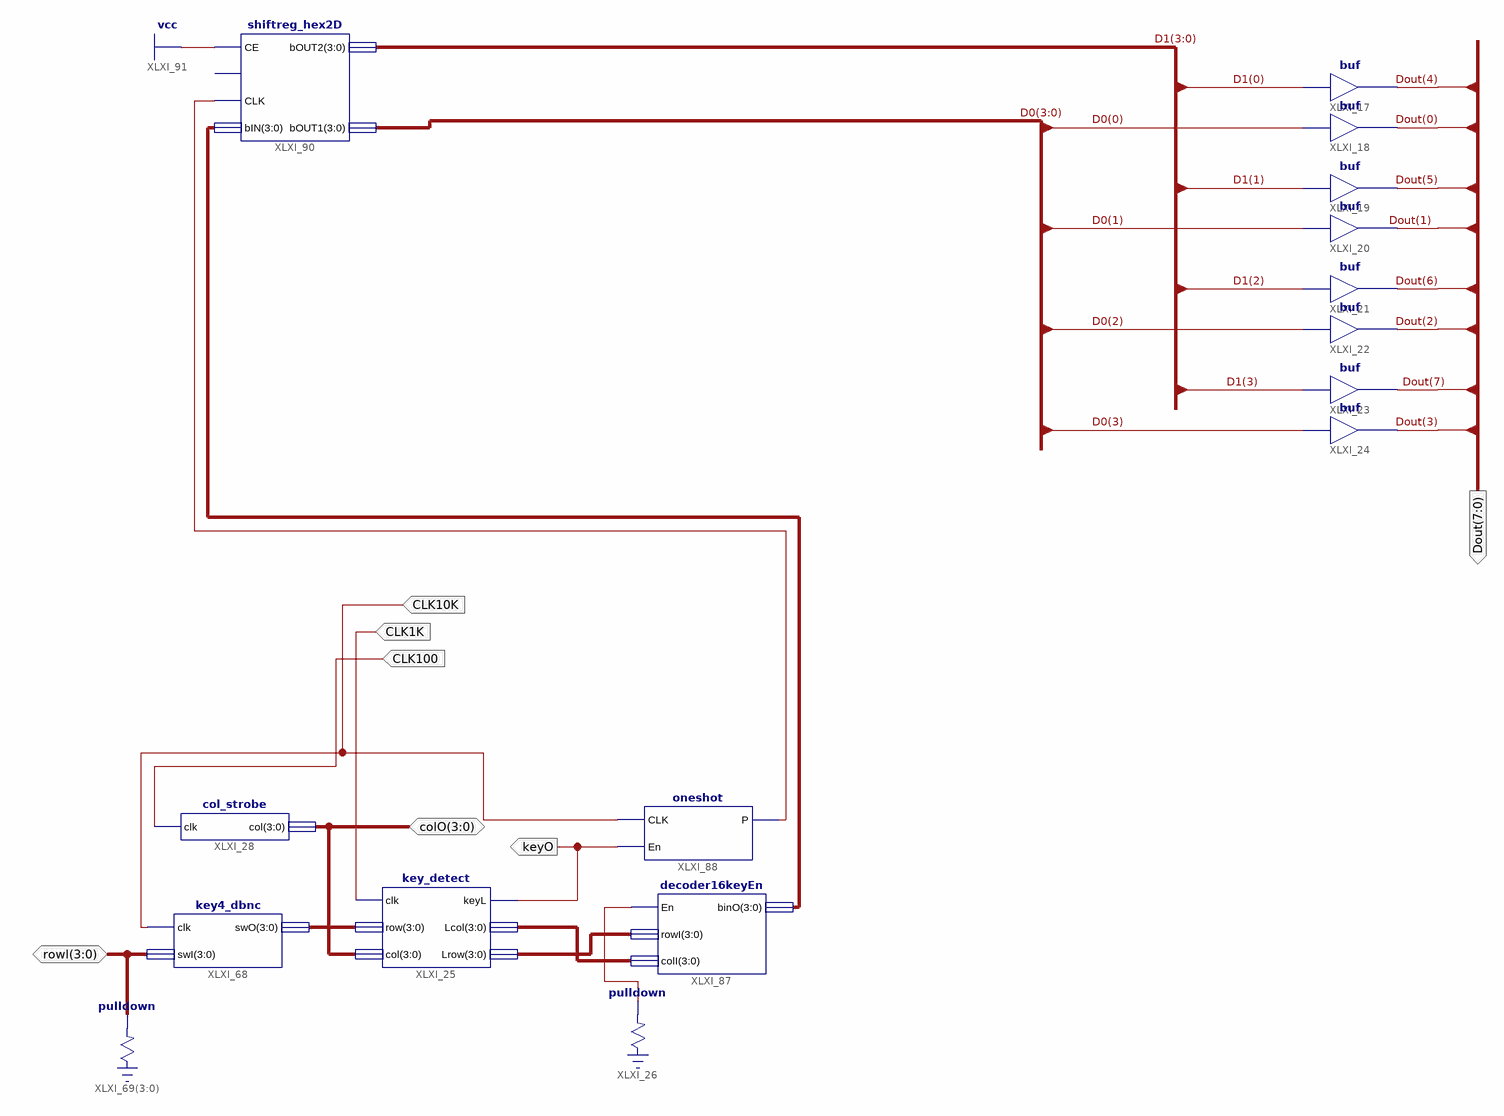
[diagram p0: schematic sheet 1]
// Xilinx ISE schematic keypadM.sch (spartan3e) as structural Verilog: 16 symbols, 7 ports
module keypadM (
  input  CLK1K,
  input  CLK100,
  input  CLK10K,
  inout  [3:0] rowl,
  inout  [3:0] colO,
  output [7:0] Dout,
  output keyO
);

  wire XLXN_27, XLXN_336;
  wire [3:0] D0, D1, XLXN_25, XLXN_26, XLXN_29, XLXN_337;

  buf XLXI_17 (Dout[4], D1[0]);
  buf XLXI_18 (Dout[0], D0[0]);
  buf XLXI_19 (Dout[5], D1[1]);
  buf XLXI_20 (Dout[1], D0[1]);
  buf XLXI_21 (Dout[6], D1[2]);
  buf XLXI_22 (Dout[2], D0[2]);
  buf XLXI_23 (Dout[7], D1[3]);
  buf XLXI_24 (Dout[3], D0[3]);
  \pulldown  XLXI_26 (.O(XLXN_27));
  key4_dbnc XLXI_68 (.clk(CLK10K), .swI(rowl), .swO(XLXN_29));
  \pulldown  XLXI_69[3:0] (.O(rowl));
  key_detect XLXI_25 (.clk(CLK1K), .row(XLXN_29), .col(colO), .keyL(keyO), .Lcol(XLXN_25), .Lrow(XLXN_26));
  col_strobe XLXI_28 (.clk(CLK100), .col(colO));
  decoder16keyEn XLXI_87 (.En(XLXN_27), .rowI(XLXN_26), .colI(XLXN_25), .binO(XLXN_337));
  oneshot XLXI_88 (.CLK(CLK10K), .En(keyO), .P(XLXN_336));
  shiftreg_hex2D XLXI_90 (.CE(1'b1), .CLK(XLXN_336), .bIN(XLXN_337), .bOUT2(D1), .bOUT1(D0));  // open: RST
endmodule
